# Altium schematic sheet SectionE_BreakOut.SchDoc
size A4
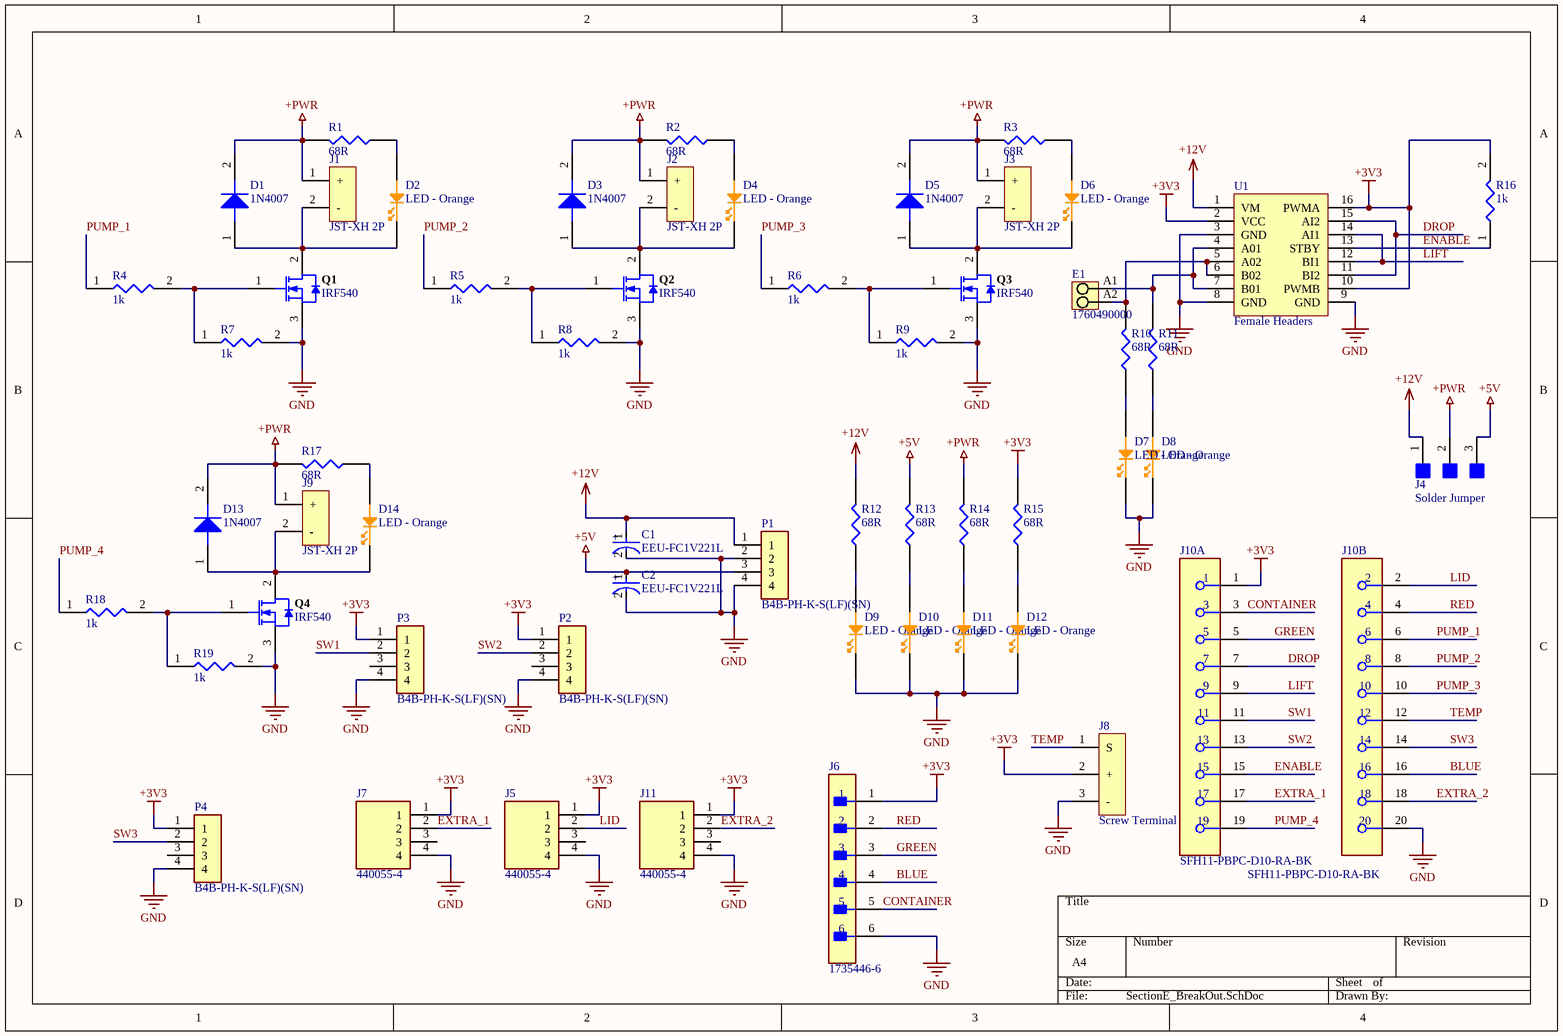
[diagram p0: SectionE_BreakOut.SchDoc]

## Parts
C1  EEU-FC1V221L  [FP-EEU-FC1V221L-MFG]
C2  EEU-FC1V221L  [FP-EEU-FC1V221L-MFG]
D1  1N4007  [M7 1N4007 SMA]
D2  LED - Orange  [LED0603-Orange]
D3  1N4007  [M7 1N4007 SMA]
D4  LED - Orange  [LED0603-Orange]
D5  1N4007  [M7 1N4007 SMA]
D6  LED - Orange  [LED0603-Orange]
D7  LED - Orange  [LED0603-Orange]
D8  LED - Orange  [LED0603-Orange]
D9  LED - Orange  [LED0603-Orange]
D10  LED - Orange  [LED0603-Orange]
D11  LED - Orange  [LED0603-Orange]
D12  LED - Orange  [LED0603-Orange]
D13  1N4007  [M7 1N4007 SMA]
D14  LED - Orange  [LED0603-Orange]
E1  1760490000  [PM_5_08_90_02]
J1  JST-XH 2P  [JST-XH 2P]
J2  JST-XH 2P  [JST-XH 2P]
J3  JST-XH 2P  [JST-XH 2P]
J4  Solder Jumper  [Solder Jumper]
J5  440055-4  [TE_440055-4]
J6  1735446-6  [FP-1735446-6-MFG]
J7  440055-4  [TE_440055-4]
J8  Screw Terminal  [Screw Terminal 3P 5.08MM]
J9  JST-XH 2P  [JST-XH 2P]
J10  SFH11-PBPC-D10-RA-BK  [FP-SFH11-PBPC-D10-RA-BK-MFG]  (parts A,B of 2)
J11  440055-4  [TE_440055-4]
P1  B4B-PH-K-S(LF)(SN)  [JST_B4B-PH-K-S(LF)(SN)]
P2  B4B-PH-K-S(LF)(SN)  [JST_B4B-PH-K-S(LF)(SN)]
P3  B4B-PH-K-S(LF)(SN)  [JST_B4B-PH-K-S(LF)(SN)]
P4  B4B-PH-K-S(LF)(SN)  [JST_B4B-PH-K-S(LF)(SN)]
Q1  IRF540  [VISH-TO-220AB-3_A]
Q2  IRF540  [VISH-TO-220AB-3_A]
Q3  IRF540  [VISH-TO-220AB-3_A]
Q4  IRF540  [VISH-TO-220AB-3_A]
R1  68R  [68R 0603]
R2  68R  [68R 0603]
R3  68R  [68R 0603]
R4  1k  [R0603 1k]
R5  1k  [R0603 1k]
R6  1k  [R0603 1k]
R7  1k  [R0603 1k]
R8  1k  [R0603 1k]
R9  1k  [R0603 1k]
R10  68R  [68R 0603]
R11  68R  [68R 0603]
R12  68R  [68R 0603]
R13  68R  [68R 0603]
R14  68R  [68R 0603]
R15  68R  [68R 0603]
R16  1k  [R0603 1k]
R17  68R  [68R 0603]
R18  1k  [R0603 1k]
R19  1k  [R0603 1k]
U1  Female Headers  [TB6612FNG]

## Nets
+3V3: J5.1 J6.1 J7.1 J8.2(+) J10.1 J11.1 P2.1 P3.1 P4.1 R15.2 R16.2 U1.2(VCC) U1.10(PWMB) U1.16(PWMA)
+5V: C2.1(C) J4.3 P1.3 R13.2
+12V: C1.1(C) J4.1 P1.1 R12.2 U1.1(VM)
+PWR: D1.2(Cathode) D3.2(Cathode) D5.2(Cathode) D13.2(Cathode) J1.1(+) J2.1(+) J3.1(+) J4.2 J9.1(+) R1.2 R2.2 R3.2 R14.2 R17.2
GND: C1.2(A) C2.2(A) D7.1(Cathode) D8.1(Cathode) D9.1(Cathode) D10.1(Cathode) D11.1(Cathode) D12.1(Cathode) J5.4 J6.6 J7.4 J8.3(-) J10.20 J11.4 P1.2 P1.4 P2.4 P3.4 P4.4 Q1.3(S) Q2.3(S) Q3.3(S) Q4.3(S) R7.2 R8.2 R9.2 R19.2 U1.3(GND) U1.8(GND) U1.9(GND)
BLUE: J6.4 J10.16
CONTAINER: J6.5 J10.3
DROP: J10.7 U1.11(BI2) U1.15(AI2)
ENABLE: J10.15 R16.1 U1.13(STBY)
EXTRA_1: J7.2 J10.17
EXTRA_2: J10.18 J11.2
GREEN: J6.3 J10.5
LID: J5.2 J10.2
LIFT: J10.9 U1.12(BI1) U1.14(AI1)
PUMP_1: J10.6 R4.1
PUMP_2: J10.8 R5.1
PUMP_3: J10.10 R6.1
PUMP_4: J10.19 R18.1
RED: J6.2 J10.4
SW1: J10.11 P3.2
SW2: J10.13 P2.2
SW3: J10.14 P4.2
TEMP: J8.1(S) J10.12
NetD1_1: D1.1(Anode) D2.1(Cathode) J1.2(-) Q1.2(D)
NetD2_2: D2.2(Anode) R1.1
NetD3_1: D3.1(Anode) D4.1(Cathode) J2.2(-) Q2.2(D)
NetD4_2: D4.2(Anode) R2.1
NetD5_1: D5.1(Anode) D6.1(Cathode) J3.2(-) Q3.2(D)
NetD6_2: D6.2(Anode) R3.1
NetD7_2: D7.2(Anode) R10.1
NetD8_2: D8.2(Anode) R11.1
NetD9_2: D9.2(Anode) R12.1
NetD10_2: D10.2(Anode) R13.1
NetD11_2: D11.2(Anode) R14.1
NetD12_2: D12.2(Anode) R15.1
NetD13_1: D13.1(Anode) D14.1(Cathode) J9.2(-) Q4.2(D)
NetD14_2: D14.2(Anode) R17.1
NetE1_A1: E1.A1 R11.2 U1.4(A01) U1.7(B01)
NetE1_A2: E1.A2 R10.2 U1.5(A02) U1.6(B02)
NetQ1_1: Q1.1(G) R4.2 R7.1
NetQ2_1: Q2.1(G) R5.2 R8.1
NetQ3_1: Q3.1(G) R6.2 R9.1
NetQ4_1: Q4.1(G) R18.2 R19.1

Not connected (* = marked no-connect by the designer): J5 3; J7 3; J11 3; P2 3; P3 3; P4 3

## Notes on the sheet
- (in symbol CMP-05427-000010-1) +

## Library data of the parts
C1 C2 = CMP-05427-000010-1: CAP ALUM 220UF 20% 35V RADIAL; Manufacturer: Panasonic Electronic Components; Material: Aluminum; Leakage Current: 77uA; Esr: 0.085Ω; Life: 2000Hours; Automotive Grade: Grade 2; Dissipation Factor: 12%; Ripple Current: 730mA; Octopart: https://octopart.com/eeu-fc1v221l-panasonic-39478519; ComponentLink2URL: https://industrial.panasonic.com/cdbs/www-data/pdf/RDF0000/ABA0000C1209.pdf; Package: 0; Height: 16.5mm; Category: Cap; Value: 220uF; ComponentLink2Description: Datasheet; Lead Free: Yes; Device Class L2: Capacitors; Temperature Range High: +105°C; Mouser Description: Capacitor; Aluminum Electrolytic; Fc Radial Elec Cap 220uF 35V; Temperature: -55°C to +105°C; Digikey Description: CAP ALUM 220UF 20% 35V RADIAL; Device Class L3: Aluminum Electrolytic Capacitors; Manufacturer Part Number: EEU-FC1V221L; Device Class L1: Passive Components; Automotive: Yes; RoHS: TRUE; Temperature Range Low: -55°C; Capacitance: 220uF; Voltage Rating: 35V; Tolerance: 20%
D1 D3 D5 D13 = 1N4007FLTR: 1000V 1A Rectifier; Manufacturer: Sangdest Microelectronics; Supplier 1: Digi-Key; Supplier Part Number 1: 1655-1N4007FLCT-ND; Manufacturer Part Number: 1N4007FLTR; RoHS: No; Stock 1: 2517; Pricing 1: 1=0.10000, 10=0.06600, 100=0.03120, 500=0.01848, 1000=0.01241 (USD)
D2 D4 D6-D12 D14 = LTST-C191KFKT: LED ORANGE CLEAR SMD; Manufacturer: Vishay Lite-On; Lens Color: Colorless; Wavelength: 611nm; Number of LEDs: 1; Viewing Angle: 130°; Lens Style: Diffused,Colorless,Rectangular; Luminous Intensity: 90mcd; Forward Current: 30mA; Forward Voltage: 2V; Power Rating: 75mW; Reverse Voltage: 5V; Dominant Wavelength: 605nm; Test Current: 20mA; Supplier 1: Digi-Key; Supplier Part Number 1: 160-1445-1-ND; Manufacturer Part Number: LTST-C191KFKT; RoHS: Yes; Category: LEDs; Stock 1: 92562; Pricing 1: 1=0.24000, 10=0.17900, 100=0.08460, 500=0.05640, 1000=0.04418, 2500=0.04324 (USD); Mount: Surface Mount; Case/Package: 0603; Number of Pins: 2; Case Code (Metric): 1608; Color: Orange; Case Code (Imperial): 0603; Min Operating Temperature: -55°C; Max Operating Temperature: 85°C; Package Quantity: 1; Packaging: Tape and Reel; Illumination Color: Orange; Lens Transparency: Clear; Number of Elements: 1; Power Dissipation: 75mW; Length: 1.6mm; Height: 0.55mm; Width: 0.8mm; Depth: 0.8mm; Radiation Hardening: No; Lead Free: Lead Free; ComponentLink1URL: https://datasheet.ciiva.com/2109/ltst-c191kfkt-2109968.pdf?src-supplier=Digi-Key; ComponentLink1Description: https://datasheet.ciiva.com/2109/ltst-c191kfkt-2109968.pdf?src-supplier=Digi-Key; ComponentLink2URL: https://datasheet.ciiva.com/12400/100-ltst-c191kfkt-39904-12400811.pdf?src-supplier=Mouser; ComponentLink2Description: https://datasheet.ciiva.com/12400/100-ltst-c191kfkt-39904-12400811.pdf?src-supplier=Mouser; ComponentLink3URL: https://datasheet.ciiva.com/11775/0900766b80dc02b0-11775613.pdf?src-supplier=RSComponents; ComponentLink3Description: https://datasheet.ciiva.com/11775/0900766b80dc02b0-11775613.pdf?src-supplier=RSComponents; ComponentLink4URL: https://datasheet.ciiva.com/15201/getdatasheetpartid-631075-15201391.pdf?src-supplier=Verical; ComponentLink4Description: https://datasheet.ciiva.com/15201/getdatasheetpartid-631075-15201391.pdf?src-supplier=Verical; ComponentLink5URL: https://datasheet.ciiva.com/2109/s-110-ltst-c191kfkt-2109969.pdf?src-supplier=Digi-Key; ComponentLink5Description: https://datasheet.ciiva.com/2109/s-110-ltst-c191kfkt-2109969.pdf?src-supplier=Digi-Key
E1 = CMP-1559-01627-1: OMNIMATE Signal - series PM; Manufacturer: Weidmueller; Contact_surface: tinned; Pitch_mm: 5,08 mm; Solid_min_H05_07_V_U: 0,13 mm²; Wire_cross_section_AWG_min_UL_1059: AWG 26; Wire_cross_section_AWG_max_UL_1059: AWG 14; Rated_voltage_for_surge_voltage_class_pollution_degree_II_2: 600 V; Rated_current_use_group_B_UL_1059: 15 A; Mounting_onto_the_PCB: Solder connection; Solder_pin_length_mm: 3,5 mm; Side_termination_characteristic: closed side; Contact_material: Cu-Leg; Pitch_inch: 0,2 inch; No_of_poles: 2; UL_94_flammability_rating: V-0; Insulating_material: Wemid (PA); Rated_voltage_use_group_B_UL_1059: 300 V; Solid_max_H05_07_V_U: 2,5 mm²; Short_text_for_material: PM 5.08/02/90 3.5SN OR BX; Revision: V1; PartNumber: 1760490000; Qty: 500 PCS; ComponentLink2Description: URL Link1; Packaging: Box; PackageReference: PM_5_08_90_02; ComponentLink2URL: http://catalog.weidmueller.com/catalog/Start.do?localeId=en&ObjectID=1760490000; Colour: Orange; ComponentLink1Description: Manufacturer URL; ComponentLink1URL: http://www.weidmueller.com/
J1-J3 J9 = B2B-XH-A(LF)(SN): JST-XH 2 POS 2.5mm Solder ST Thru-Hole Box; Manufacturer: JST; Number of Positions: 2; Connector Type: Male Pin; Contact Resistance: 20mR; Max Current Rating: 3A; Max Voltage Rating (AC): 250V; Insulation Resistance: 1GR; Wire/Cable Gauge: 22AWG; Supplier 1: Element14; Supplier Part Number 1: 1516276; Manufacturer Part Number: B2B-XH-A(LF)(SN); RoHS: Yes; Category: FFC / FPC; Stock 1: 165899; Mount: Through Hole; Contact Plating: Tin,Copper,Lead; Color: Natural; Contact Material: Brass; Housing Color: White; Housing Material: Polyamide; Min Operating Temperature: -25°C; Max Operating Temperature: 85°C; Number of Rows: 1; Packaging: Bulk; Termination: Solder; Fastening Type: Detent; Orientation: Straight; Current Rating: 3A; Voltage Rating: 250V; Voltage Rating (AC): 250V; Number of Contacts: 2; Max Voltage Rating (DC): 250V; Length: 7.4mm; Pitch: 2.5mm; Depth: 5.75mm; Lead Pitch: 2.5mm; Lead Free: Lead Free; REACH SVHC: No SVHC; ComponentLink1URL: https://datasheet.ciiva.com/26894/getdatasheetpartid-640357-26894434.pdf?src-supplier=Verical; ComponentLink1Description: https://datasheet.ciiva.com/26894/getdatasheetpartid-640357-26894434.pdf?src-supplier=Verical; ComponentLink2URL: https://datasheet.ciiva.com/11746/0900766b8082653e-11746979.pdf?src-supplier=RSComponents; ComponentLink2Description: https://datasheet.ciiva.com/11746/0900766b8082653e-11746979.pdf?src-supplier=RSComponents; ComponentLink3URL: https://datasheet.ciiva.com/26894/getdatasheetpartid-385291-26894760.pdf?src-supplier=Verical; ComponentLink3Description: https://datasheet.ciiva.com/26894/getdatasheetpartid-385291-26894760.pdf?src-supplier=Verical; ComponentLink4URL: https://datasheet.ciiva.com/8052/5448-8052024.pdf?src-supplier=Element14; ComponentLink4Description: https://datasheet.ciiva.com/8052/5448-8052024.pdf?src-supplier=Element14; ComponentLink5URL: https://datasheet.ciiva.com/20207/523653-20207167.pdf?src-supplier=Rapid+Electronics; ComponentLink5Description: https://datasheet.ciiva.com/20207/523653-20207167.pdf?src-supplier=Rapid+Electronics
J5 J7 J11 = 440055-4: 2.0MM,HDR,4POS,R/A; MF: TE Connectivity; Number_of_Positions: 4; Product_Type: Connector; Centerline_Pitch: 2 mm[.079 in]; MP: 440055-4; Price: None; Package: None; DigiKey-Purchase-URL: https://snapeda.com/shop?store=DigiKey&id=2374829; Value: *; Availability: Unavailable; EU_RoHS_Compliance: Compliant; Mouser-Purchase-URL: https://snapeda.com/shop?store=Mouser&id=2374829; SnapEDA_Link: https://www.snapeda.com/parts/440055-4/TE%20Connectivity%20AMP%20Connectors/view-part/2374829/?ref=snap
J6 = CMP-03369-000087-1: CONN HEADER VERT 6POS 2MM; Manufacturer: TE; Conn Gender: Male; Conn Orientation: Vertical; Current Rating: 3A; Voltage Rating: 100V; Number Of Contacts: 6; Device Class L1: Connectors; RoHS: TRUE; Pitch: 2mm; Number Of Rows: 1; Device Class L2: Headers and Wire Housings; Digikey Description: CONN HEADER VERT 6POS 2MM; Category: Conn; Automotive: No; Device Class L3: unset; Lead Free: Yes; Package: 1735446-6; Height: 6.37mm; Temperature: -25°C to +85°C; Contact Material: Tin,Nickel; Mouser Description: Headers & Wire Housings 6 POS HDR VERT 2.0mm; Octopart: https://octopart.com/1735446-6-te+connectivity-42205942; Temperature Range High: +85°C; ComponentLink2URL: https://www.te.com/usa-en/product-1735446-6.html; ComponentLink2Description: Datasheet; Temperature Range Low: -25°C; Manufacturer Part Number: 1735446-6
J8 = OSTTC032162: TERM BLK 3P SIDE ENT 5.08MM PCB; Manufacturer: On-Shore Technology; Plating: Steel; Number of Levels: 1; Number of Positions Per Level: 3; Current: 15A; Voltage: 300V; Pitch: 0.2inch; Wire Gauge (Max): 22AWG; Wire Gauge (Min): 14AWG; Supplier 1: Digi-Key; Supplier Part Number 1: ED2610-ND; Manufacturer Part Number: OSTTC032162; RoHS: Yes; Category: Terminal Blocks; Stock 1: 3645; Pricing 1: 1=0.85000, 10=0.53000, 25=0.45400, 50=0.40800, 100=0.39950, 250=0.34000, 500=0.32300, 1000=0.28900, 5000=0.22610 (USD); Mount: Through Hole; Contact Plating: Tin; Housing Color: Blue; Color: Blue; Housing Material: Thermoplastic; Contact Material: Brass; Min Operating Temperature: -30°C; Max Operating Temperature: 105°C; Termination: Screw; Number of Contacts: 3; Packaging: Bulk; Number of Rows: 1; Max Current Rating: 15A; Number of Positions: 3; Length: 15.2mm; Height: 10mm; Width: 7.6mm; Lead Free: Lead Free; Flammability Rating: UL94 V-0; ComponentLink1URL: https://datasheet.ciiva.com/823/osttcxx2162-823568.pdf?src-supplier=Digi-Key; ComponentLink1Description: https://datasheet.ciiva.com/823/osttcxx2162-823568.pdf?src-supplier=Digi-Key; ComponentLink2URL: https://datasheet.ciiva.com/19458/2120655-19458972.pdf?src-supplier=Jameco; ComponentLink2Description: https://datasheet.ciiva.com/19458/2120655-19458972.pdf?src-supplier=Jameco
J10 = CMP-25680-000003-1: CONN HDR 20POS 0.1 GOLD PCB R/A; Manufacturer: Sullins; Conn Orientation: Right Angle; Current Rating: 3A; Conn Gender: Female; Number Of Contacts: 20; Pitch: 2.54mm; Is Female: yes; Package: SFH11-PBPC-D10-RA-BK; Number Of Rows: 2; Automotive: No; Footprint Url: https://drawings-pdf.s3.amazonaws.com/11161.pdf; Category: Conn; Temperature Range Low: -40°C; Manufacturer Part Number: SFH11-PBPC-D10-RA-BK; Lead Free: Yes; Octopart: https://octopart.com/sfh11-pbpc-d10-ra-bk-sullins-12270496; Temperature: -40°C to +105°C; Contact Material: Gold,Nickel; ComponentLink2URL: https://s3.amazonaws.com/catalogspreads-pdf/PAGE123%20.100%20SFH11%20SERIES%20FEMALE%20HDR%20ST%20RA.pdf; ComponentLink2Description: Datasheet; Device Class L2: Headers and Wire Housings; Digikey Description: CONN HDR 20POS 0.1 GOLD PCB R/A; Temperature Range High: +105°C; RoHS: TRUE; Device Class L1: Connectors; Device Class L3: unset; Height: 7.2mm
P1-P4 = B4B-PH-K-S(LF)(SN): Connector Header Through Hole 4 position 0.079 _2.00mm_; MP: B4B-PH-K-S_LF__SN_; MF: JST Sales; Package: None; Value: *; SnapEDA_Link: https://www.snapeda.com/parts/B4B-PH-K-S%28LF%29%28SN%29/JST%20Sales%20America%20Inc./view-part/422410/?ref=snap; Digi-Key_Purchase_URL: https://www.digikey.com.tr/product-detail/en/jst-sales-america-inc/B4B-PH-K-S_LF__SN_/455-1706-ND/926613?utm_source=snapeda&utm_medium=aggregator&utm_campaign=symbol; Digi-Key_Part_Number: 455-1706-ND
Q1-Q4 = CMP-2000-06461-1: Power MOSFET, 100 VDS, -55 to 175 degC, 3-Pin TO-220AB, RoHS, Tube; Manufacturer: Vishay; Typical Turn-Off Delay Time: 53ns; Channel Mode: Enhancement; Unit Weight: 0.211644oz; Transistor Type: 1N-Channel; Vgs - Gate-Source Voltage: 20V; Transistor Polarity: N-Channel; Vds - Drain-Source Breakdown Voltage: 100V; Configuration: Single; Number of Channels: 1Channel; Pd - Power Dissipation: 150W; Brand: VishaySemiconductors; Rds On - Drain-Source Resistance: 77mOhms; Id - Continuous Drain Current: 28A; Rise Time: 44ns; Fall Time: 43ns; Typical Turn-On Delay Time: 11ns; &lt;PCN&gt;: http://www.mouser.com/PCN/Vishay_SIL_0182015.pdf; Maximum Operating Temperature: +175C; Product Category: MOSFET; Datasheet URL: http://www.vishay.com/docs/91021/91021.pdf; Length: 10.51mm; Height: 9.01mm; Factory Pack Quantity: 50; Width: 4.7mm; Packaging: Tube; Package Reference: TO-220AB-3; Package / Case: TO-220-3; Mounting Style: ThroughHole; Manufacturer URL: http://www.vishay.com/; Mounting Technology: ThroughHole; Package URL: http://www.vishay.com/docs/71195/to220ab.pdf; RoHS: NoRoHSVersionAvailable; Technology: Si; Minimum Operating Temperature: -55C; Package Description: 3-Pin Flange Mount, Body 10.275 x 4.45 mm, Pitch 2.54 mm; Datasheet Version: Rev. B, 03/2011
R1-R3 R10-R15 R17 = CRGP0603F68R: CRGP 0603 68R 1%; Manufacturer: TE Connectivity; Max Power Dissipation: 250mW; Temperature Coefficient: 200ppm/°C; Supplier 1: Digi-Key; Supplier Part Number 1: A130402CT-ND; Manufacturer Part Number: CRGP0603F68R; RoHS: No; Category: Chip SMD Resistors; Stock 1: 49308; Pricing 1: 1=0.14000, 10=0.11400, 100=0.04470, 1000=0.01870, 2500=0.01714 (USD); Case/Package: 0603; Case Code (Imperial): 0603; Case Code (Metric): 1608; Min Operating Temperature: -55°C; Max Operating Temperature: 155°C; Resistor Type: Thick Film; Packaging: Tape and Reel; Resistance: 68R; Tolerance: 1%; Number of Terminations: 2; ComponentLink1URL: https://www.te.com/commerce/DocumentDelivery/DDEController?Action=srchrtrv&amp;DocNm=9-1773463-9&amp;DocType=DS&amp;DocLang=English&src-supplier=Digi-Key; ComponentLink1Description: https://www.te.com/commerce/DocumentDelivery/DDEController?Action=srchrtrv&amp;DocNm=9-1773463-9&amp;DocType=DS&amp;DocLang=English&src-supplier=Digi-Key
R4-R9 R16 R18 R19 = CRGCQ0603F1K0: 0603 1k Ohm 1% 1/10W; Manufacturer: TE Connectivity; Resistance: 1kR; Max Power Dissipation: 100mW; Temperature Coefficient: 100ppm/°C; Supplier 1: Digi-Key; Supplier Part Number 1: A129688CT-ND; Manufacturer Part Number: CRGCQ0603F1K0; RoHS: No; Category: Chip SMD Resistors; Stock 1: 37973; Pricing 1: 1=0.10000, 10=0.02700, 100=0.01090, 1000=0.00490, 2500=0.00426 (USD); Case/Package: 0603; Case Code (Imperial): 0603; Case Code (Metric): 1608; Min Operating Temperature: -55°C; Max Operating Temperature: 155°C; Resistor Type: Thick Film; Features: Moisture Resistant,Automotive AEC-Q200; Packaging: Cut Tape; Tolerance: 1%; Number of Terminations: 2; ComponentLink1URL: https://www.te.com/commerce/DocumentDelivery/DDEController?Action=srchrtrv&DocNm=1773204-3&DocType=DS&DocLang=English&src-supplier=Digi-Key; ComponentLink1Description: https://www.te.com/commerce/DocumentDelivery/DDEController?Action=srchrtrv&DocNm=1773204-3&DocType=DS&DocLang=English&src-supplier=Digi-Key; ComponentLink2URL: https://4donline.ihs.com/images/VipMasterIC/IC/TYEL/TYEL-S-A0004929575/TYEL-S-A0004929575-1.pdf?hkey=52A5661711E402568146F3353EA87419&src-supplier=Farnell; ComponentLink2Description: https://4donline.ihs.com/images/VipMasterIC/IC/TYEL/TYEL-S-A0004929575/TYEL-S-A0004929575-1.pdf?hkey=52A5661711E402568146F3353EA87419&src-supplier=Farnell; ComponentLink3URL: https://www.te.com/commerce/DocumentDelivery/DDEController?Action=srchrtrv&amp;DocNm=1773204-3&amp;DocType=DS&amp;DocLang=English&src-supplier=Digi-Key; ComponentLink3Description: https://www.te.com/commerce/DocumentDelivery/DDEController?Action=srchrtrv&amp;DocNm=1773204-3&amp;DocType=DS&amp;DocLang=English&src-supplier=Digi-Key; ComponentLink4URL: https://4donline.ihs.com/images/VipMasterIC/IC/TYEL/TYEL-S-A0004929575/TYEL-S-A0004929575-1.pdf?hkey=52A5661711E402568146F3353EA87419&src-supplier=Element14; ComponentLink4Description: https://4donline.ihs.com/images/VipMasterIC/IC/TYEL/TYEL-S-A0004929575/TYEL-S-A0004929575-1.pdf?hkey=52A5661711E402568146F3353EA87419&src-supplier=Element14; ComponentLink5URL: https://4donline.ihs.com/images/VipMasterIC/IC/TYEL/TYEL-S-A0004929575/TYEL-S-A0004929575-1.pdf?hkey=52A5661711E402568146F3353EA87419&src-supplier=Newark; ComponentLink5Description: https://4donline.ihs.com/images/VipMasterIC/IC/TYEL/TYEL-S-A0004929575/TYEL-S-A0004929575-1.pdf?hkey=52A5661711E402568146F3353EA87419&src-supplier=Newark
U1 = TB6612FNG Female: Motor Driver